# EAGLE design VentCU_pcb_final (EAGLE 9.5.1)
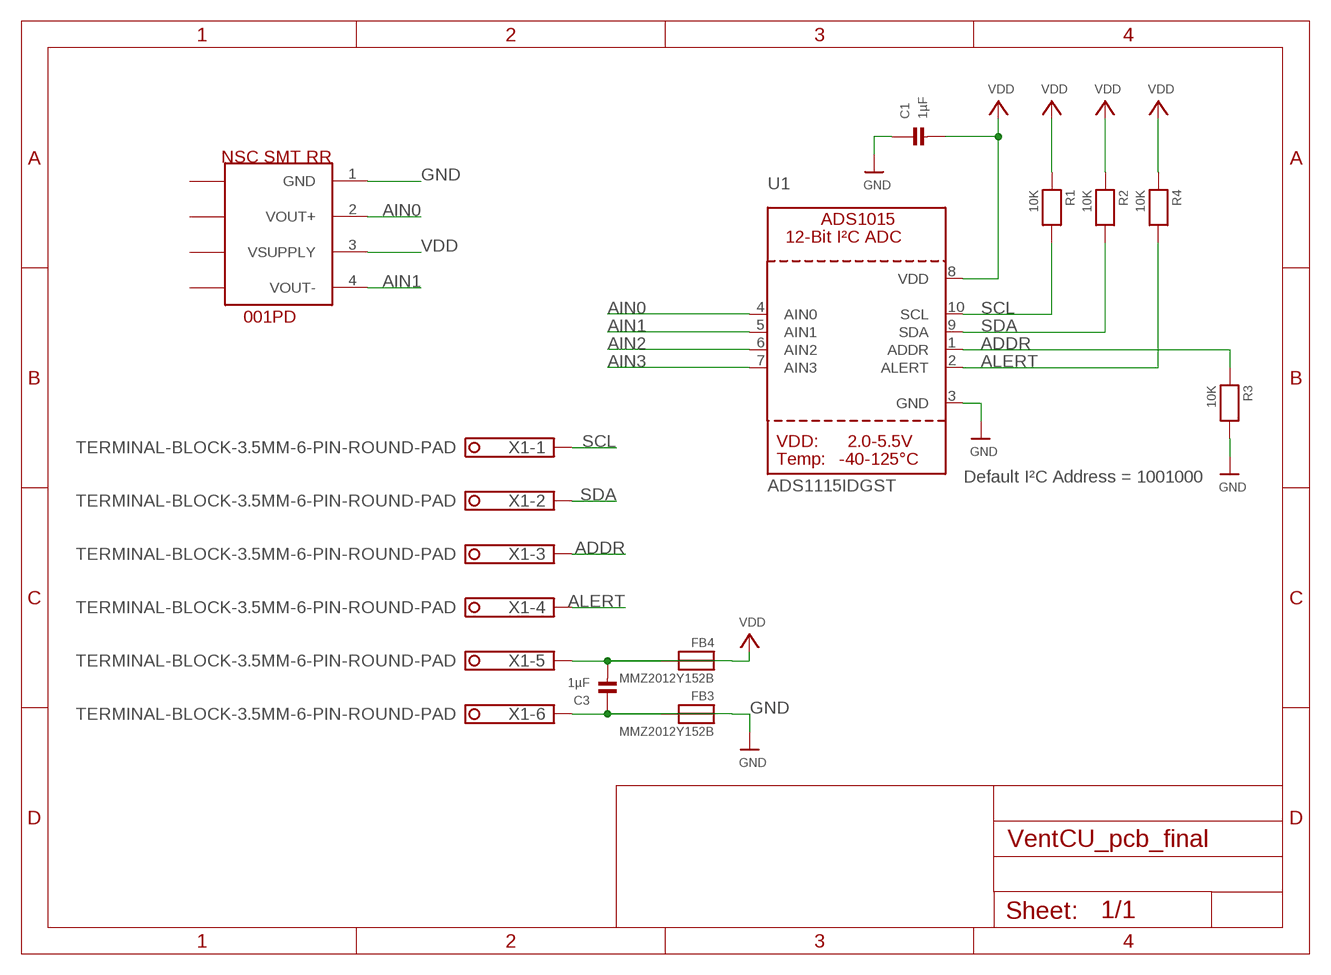
[diagram p0: schematic, sheet 1]

## Parts
C1  1µF  CAP_CERAMIC0805  [0805]
C3  1µF  CAP_CERAMIC0805  [0805]
FB3  MMZ2012Y152B  FERRITE0805  [0805]
FB4  MMZ2012Y152B  FERRITE0805  [0805]
R1  10K  RESISTOR0805  [0805]
R2  10K  RESISTOR0805  [0805]
R3  10K  RESISTOR0805  [0805]
R4  10K  RESISTOR0805  [0805]
U1  ADS1115IDGST  ADC_ADS1015  [MSOP10]
U$1  NSC-M  [NSC-M]
X1  TERMINAL-BLOCK-3.5MM-6-PIN-ROUND-PAD  [TERMINAL-BLOCK-6-PIN-3.5MM-ROUND-PAD]

## Nets
ADDR: R3.1 U1.1(ADDR) X1.3
AIN0: U1.4(AIN0) U$1.2(VOUT+)
AIN1: U1.5(AIN1) U$1.4(VOUT-)
AIN2: U1.6(AIN2)
AIN3: U1.7(AIN3)
ALERT: R4.2 U1.2(ALERT) X1.4
GND: C1.1 C3.1 FB3.1 R3.2 U1.3(GND) U$1.1(GND)
N$1: FB4.2 X1.5
N$2: FB3.2 X1.6
SCL: R1.2 U1.10(SCL) X1.1
SDA: R2.2 U1.9(SDA) X1.2
VDD: C1.2 C3.2 FB4.1 R1.1 R2.1 R4.1 U1.8(VDD) U$1.3(VSUPPLY)
Unconnected: U$1.5(NC5) U$1.6(NC6) U$1.7(NC7) U$1.8(NC8)

## Notes on the sheet
- Default I²C Address = 1001000

## Library data of the parts
C1 C3 = microbuilder:CAP_CERAMIC: Ceramic Capacitors 0402 - 0402 Surface Mount Capacitors 16pF 50V 5% [Digikey: 445-4899-2-ND] 18pF 50V 5% [Digikey: 490-1281-2-ND] 22pF 50V 5% [Digikey: 490-1283-2-ND] 68pF 50V 5% [Digikey: 490-1289-2-ND] 0.1uF 10V 10% [Digikey: 490-1318-2-ND] 1.0uF 6.3V 10% [Digikey: 490-1320-2-ND] 0603 - 0603 Surface Mount Capacitors 16 pF 50V 5% [Digikey: 445-5051-2-ND] 22 pF 50V [Digikey: PCC220ACVTR-ND] 33 pF 50V 5% [Digikey: 490-1415-1-ND] 56pF 50V 5% [Digikey: 490-1421-1-ND] 220pF 50V 5% [Digikey: 445-1285-1-ND] 680 pF 50V 2200 pF 50V 5% C0G [Digikey: 445-1297-1-ND] 5600 pF 100V 5% X7R [Digikey: 478-3711-1-ND] 0.1 µF 25V 10% [Digikey: PCC2277TR-ND] 0.22 µF 16V 10% X7R [Digikey: 445-1318-1-ND] 1.0 µF 25V 10% [Digikey: 445-5146-2-ND] 0603 - RF Specific 3pF 250V +/-0.1pF RF [Digikey: 712-1347-1-ND] 18 pF 250V 5% [Digikey: 478-3505-1-ND or 712-1322-1-ND] 56 pF 250V 5% C0G RF [Digikey: 490-4867-1-ND] 68 pF 250V RF [Digikey: 490-4868-1-ND] 0805 - 0805 Surface Mount Capacitors 220 pF 250V 2% RF Ceramic Capacitor [Digikey: 712-1398-1-ND] 1000 pF 50V 2% NP0 Ceramic Capacitor [Digikey: 478-3760-1-ND] 0.1 µF 25V 10% Ceramic Capacitor [Digikey: PCC1828TR-ND] 1.0 µF 16V 10% Ceramic Capacitor[Digikey: 490-1691-2-ND] 10.0 µF 10V 10% Ceramic Capacitor[Digikey: 709-1228-1-ND] 10.0 uF 16V 10% Ceramic Capacitor [Digikey: 478-5165-2-ND] 47 uF 6.3V 20% Ceramic Capacitor [Digikey: 587-1779-1-ND or 399-5506-1-ND] 1206 - 1206 Surface Mount Capacitors 47uF 10V 20% Ceramic Capacitor [Digikey: 490-5528-1-ND or 399-5508-1-ND or 445-6010-1-ND] 100uF 6.3V -20%, +80% Y5V Ceramic Capacitor (Digikey: 490-4512-1-ND, Mouser: 81-GRM31CF50J107ZE1L)
FB3 FB4 = microbuilder:FERRITE: Ferrite Bead 0603 MMZ1608B121C - 120 Ohm, 600mA Ferrite Chip - Digikey: 445-2164-1-ND BK1608HW121-T - 120 Ohm, 600mA Ferrite Chip - Digikey: 587-1876-2-ND 0805 HZ0805B272R-10 - 2.7K Ohm @ 100MHz, 200mA 0.8 Ohm DC Resistance - Digikey: 240-2504-1-ND (see also Murata BLM21BD272SN1L)
R1-R4 = microbuilder:RESISTOR: Resistors 0402 - 0402 Surface Mount Package 22 Ohm 1% 1/16W [Digikey: 311-22.0LRTR-ND] 33 Ohm 5% 1/16W 1.0K 5% 1/16W 1.5K 5% 1/16W 2.0K 1% 1/16W 10.0K 1% 1/16W [Digikey: 311-10.0KLRTR-ND] 10.0K 5% 1/16W [Digikey: RMCF0402JT10K0TR-ND] 12.1K 1% 1/16W [Digikey: 311-22.0LRTR-ND] 100.0K 5% 1/16W 0603 - 0603 Surface Mount Package 0 Ohm 1/10 Watt 1% Resistor 15 Ohm 1/10 Watt 1% Resistor 33 Ohm 1/10 Watt 1% Resistor 49.9 Ohm 1/10 Watt 1% Resistor 100 Ohm 1/10 Watt 1% Resistor 150 Ohm 1/10 Watt 1% Resistor 240 Ohm 1/10 Watt 1% Resistor 390 Ohm 1/10 Watt 1% Resistor 560 Ohm 1/10 Watt 1% Resistor 680 Ohm 1/10 Watt 1% Resistor 750 Ohm 1/10 Watt 1% Resistor 1.0K Ohm 1/10 Watt 1% Resistor 1.5K Ohm 1/10 Watt 1% Resistor 2.0K Ohm 1/10 Watt 1% Resistor 2.2K Ohm 1/10 Watt 1% Resistor 3.3K Ohm 1/10 Watt 1% Resistor 4.7K Ohm 1/10 Watt 1% Resistor 10.0K Ohm 1/10 Watt 1% Resistor 12.0K Ohm 1/10 Watt 1% Resistor 12.1K Ohm 1/10 Watt 1% Resistor 20.0K Ohm 1/10 Watt 1% Resistor 33.0K Ohm 1/10 Watt 1% Resistor 100.0K Ohm 1/10 Watt 1% Resistor 0805 - 0805 Surface Mount Package 0 Ohm 1/8 Watt 1% Resistor 33 Ohm 1/8 Watt 1% Resistor 100 Ohm 1/8 Watt 1% Resistor 150 Ohm 1/8 Watt 1% Resistor 200 Ohm 1/8 Watt 1% Resistor 240 Ohm 1/8 Watt 1% Resistor 330 Ohm 1/8 Watt 1% Resistor 390 Ohm 1/8 Watt 1% Resistor 470 Ohm 1/8 Watt 1% Resistor 1.0K Ohm 1/8 Watt 1% Resistor 1.5K Ohm 1/8 Watt 1% Resistor 2.0K Ohm 1/8 Watt 1% Resistor 4.7K Ohm 1/8 Watt 1% Resistor 5.1K Ohm 1/8 Watt 1% Resistor 5.6K Ohm 1/8 Watt 1% Resistor 10.0K Ohm 1/8 Watt 1% Resistor 22.0K Ohm 1/8 Watt 1% Resistor 33.0K Ohm 1/8 Watt 1% Resistor 100K Ohm 1/8 Watt 1% Resistor 1206 - 1206 Surface Mount Package 2012 - 2010 Surface Mount Package 0.11 Ohm 1/2 Watt 1% Resistor - Digikey: RHM.11UCT-ND
U1 = microbuilder:ADC_ADS1015: ADS1015 - 12-bit 4-Channel I2C ADC with Internal PGA VDD: 2.0-5.5V Sampling Rate: 3.3ksps Gain Settings: 2/3, 1, 2, 4, 8, 16 I2C Address: ADDR low = 1001000x, ADDR high = 1001001x Internal Comparator The ADS1015 includes an internal comparator that can be set to output a high-level on ALERT when the conversion results exceeeds a pre-defined upper level, and will deassert itself when the level falls below a pre-defined lower threshold level. It can also be set to windowed mode where the ALERT pin will be asserted if the data exceeds the upper threshold or falls below the lower threshold.
U$1 = VentCU:NSC-M
X1 = Rembrandt Electronics - Terminal Block 3-5mm v1-0:TERMINAL-BLOCK-3.5MM-6-PIN: Terminal Block 3.5mm Pitch: 3,5 mm Number of pins: 6 Created by Rembrandt Electronics www.rembrandtelectronics.com

## Board
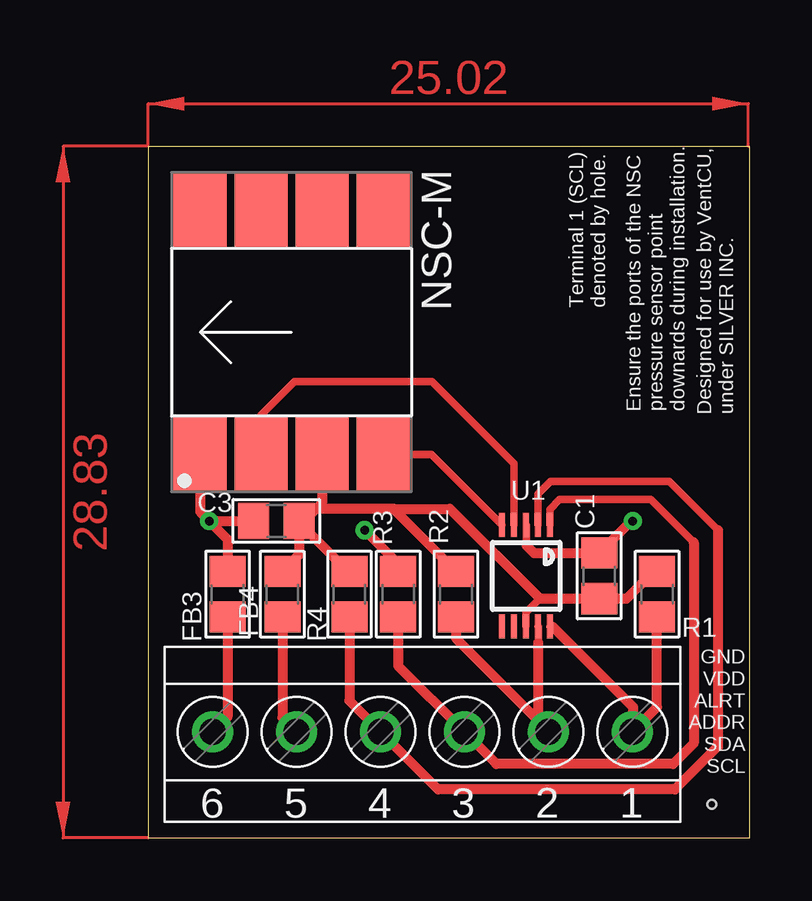
[diagram p1: board, top side]
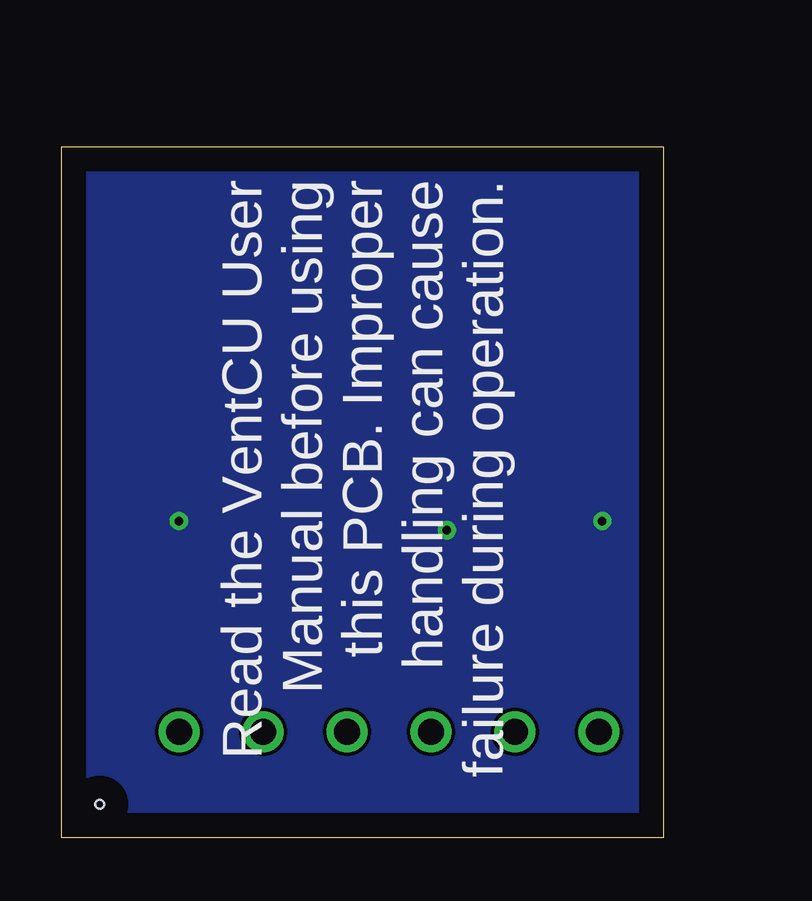
[diagram p2: board, bottom side, seen from below]

Size 25.07 x 28.82 mm. Coordinates in mm from the lower left corner, seen from the top.
Outline: 0,0 25.07,0 25.07,28.82 0,28.82 0,0
Copper layers (1*16): Top 0.035mm / dielectric 1.5mm / Bottom 0.035mm
Design rules "default": minimum track width 6mil, minimum drill 0.35mm, track to track 6mil, track to pad 6mil, pad to pad 6mil, via to via 6mil, smd to smd 6mil, copper to edge 40mil, drill to drill 6mil, minimum pad ring 10mil, minimum via ring 8mil, stop-mask expansion 4mil, vias tented up to drill 0mil, thermal gap 10mil
Holes 0.35 mm at 23.5,1.4

### Footprints (pad centres in the part's own frame; a part is rotated, then mirrored left to right if it is on the bottom)
0805 = smd 1.3 x 1.5: 1 -0.95,0; 2 0.95,0
MSOP10 = smd 0.25 x 1: 1 -1,-2.113; 2 -0.5,-2.113; 3 0,-2.113; 4 0.5,-2.113; 5 1,-2.113; 6 1,2.113; 7 0.5,2.113; 8 0,2.113; 9 -0.5,2.113; 10 -1,2.113
NSC-M = smd 2.2 x 3.1: 1 -3.81,-5.1; 2 -1.27,-5.1; 3 1.27,-5.1; 4 3.81,-5.1; 5 3.81,5.1; 6 1.27,5.1; 7 -1.27,5.1; 8 -3.81,5.1
TERMINAL-BLOCK-6-PIN-3.5MM-ROUND-PAD = drill 1.1 pad 1.7: 1 -8.75,-0.1; 2 -5.25,-0.1; 3 -1.75,-0.1; 4 1.75,-0.1; 5 5.25,-0.1; 6 8.75,-0.1

### Placement (x,y rotation side)
C1  18.8,10.92 270 top
C3  5.33,13.21 0 top
FB3  3.3,10.16 270 top
FB4  5.59,10.16 270 top
R1  21.21,10.16 270 top
R2  12.83,10.16 270 top
R3  10.41,10.16 90 top
R4  8.38,10.16 270 top
U1  15.75,10.92 180 top
U$1  5.97,21.08 0 top
X1  11.43,4.32 180 top

### Tracks (layer width: path | path; a pad name or v marks a point on that pad's centre or on a via)
ADDR
  Top 0.152: X1.3
  Top 0.305: U1.1 16.75,13.7 17.14,14.1 20.95,14.1 22.73,12.32
  Top 0.406: R3.1 10.41,7.18 X1.3 14.51,3.09 21.88,3.09 22.73,3.94 22.73,12.32
AIN0
  Top 0.305: U$1.2 4.7,17.63 6.1,19.03 11.83,19.03 15.25,15.61 U1.4
AIN1
  Top 0.305: U$1.4 11.8,15.98 U1.5
ALERT
  Top 0.305: U1.2 16.25,14.34 16.76,14.86 21.72,14.86 23.75,12.83
  Top 0.406: R4.2 8.38,5.72 X1.4 12.08,2.02 21.96,2.02 23.75,3.81 23.75,12.83
GND  (via drill 0.35)
  Top 0.152: U1.3 15.77,13.02 | 15.77,12.19 | R3.2 10.41,11.43 | 20.13,13.21 v20.19,13.21
  Top 0.305: 15.77,13.02 15.77,12.19
  Top 0.406: 15.77,12.19 16.08,11.87 C1.1 20.13,13.21 | 10.41,11.43 v9.02,12.83 | v2.54,13.21 2.16,13.59 U$1.1 | v2.54,13.21 3.3,12.44 FB3.1 | v2.54,13.21 C3.1
  pour Bottom: 25.02,28.83 25.02,-0.13 0,-0.13 0,28.83
N$1
  Top 0.406: FB4.2 5.59,5.01 X1.5
N$2
  Top 0.406: FB3.2 3.3,5.04 X1.6
SCL
  Top 0.152: 20.2,4.44 X1.1
  Top 0.33: U1.10 16.84,8.81
  Top 0.406: R1.2 21.21,5.45 X1.1 | 20.2,4.44 20.2,5.45 16.84,8.81
SDA
  Top 0.152: 16.68,4.47 X1.2
  Top 0.305: 16.26,8.13 U1.9
  Top 0.406: R2.2 12.83,8.32 16.23,4.92 16.68,4.47 | X1.2 16.26,4.84 16.26,8.13
VDD
  Top 0.152: C3.2 6.25,13.18 | R4.1 8.32,11.11
  Top 0.305: 6.48,13.21 C3.2 | U1.8 15.75,9.4 16.32,9.97
  Top 0.406: 10.22,13.72 12.57,13.72 16.32,9.97 C1.2 19.94,9.97 21.08,11.11 R1.1 | R2.1 10.22,13.72 | FB4.1 6.28,11.81 C3.2 | 8.32,11.11 6.25,13.18 | 10.22,13.72 6.99,13.72 | U$1.3 7.24,13.97 6.99,13.72 | 6.99,13.72 6.48,13.21
(copper drawn outside any net)
  shapes: Top area x2

### Text on the board
tPlace: Terminal 1 (SCL) / denoted by hole. | Ensure the ports of the NSC / pressure sensor point / downards during installation. | Designed for use by VentCU, / under SILVER INC. | GND / VDD / ALRT / ADDR / SDA / ⇐SCL
bPlace: Read the VentCU User / Manual before using / this PCB. Improper / handling can cause / failure during operation.